# Altium project SR4K_PHY6222_v1.PrjPcb
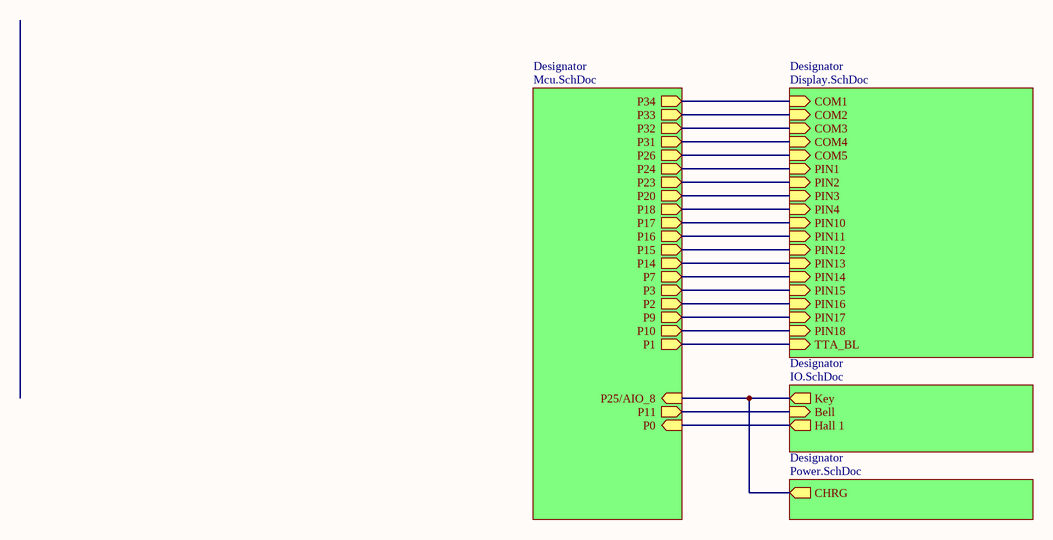
[diagram p0: Main.SchDoc]
5 sheets, 51 parts. Net scope: hierarchical (ports join the sheet entries above them; power ports are global).
Sheets:
  Main.SchDoc
    Designator = Display.SchDoc
    Designator = Power.SchDoc
    Designator = IO.SchDoc
    Designator = Mcu.SchDoc

## Sheet Main.SchDoc: SR4K_PHY6222_SIMPLIFY
size A4; DrawnBy: emmovo@outlook.com; Revision: V1.2; SheetNumber: 1; SheetTotal: 5

### Sub-sheets
Designator = Display.SchDoc: COM1 (in), TTA_BL (in), COM2 (in), COM3 (in), COM4 (in), COM5 (in), PIN1 (in), PIN2 (in), PIN3 (in), PIN4 (in), PIN10 (in), PIN11 (in), PIN12 (in), PIN13 (in), PIN14 (in), PIN15 (in), PIN16 (in), PIN17 (in), PIN18 (in)
Designator = Power.SchDoc: CHRG (out)
Designator = IO.SchDoc: Key (out), Hall 1 (out), Bell (in)
Designator = Mcu.SchDoc: P34 (out), P33 (out), P32 (out), P31 (out), P26 (out), P25/AIO_8 (in), P24 (out), P23 (out), P0 (in), P11 (out), P14 (out), P15 (out), P20 (out), P18 (out), P17 (out), P16 (out), P7 (out), P3 (out), P2 (out), P1 (out), P9 (out), P10 (out)

### Nets
CHRG: sheet Designator/CHRG, sheet Designator/Key, sheet Designator/P25/AIO_8
SWCLK: sheet Designator/PIN15, sheet Designator/P3
SWDIO: sheet Designator/PIN16, sheet Designator/P2
Uart_TX: sheet Designator/PIN17, sheet Designator/P9
NetC1_1: sheet Designator/Bell, sheet Designator/P11
NetR2_2: sheet Designator/TTA_BL, sheet Designator/P1
NetU1_3: sheet Designator/Hall 1, sheet Designator/P0
NetU2_1: sheet Designator/PIN1, sheet Designator/P24
NetU2_2: sheet Designator/PIN2, sheet Designator/P23
NetU2_3: sheet Designator/PIN3, sheet Designator/P20
NetU2_4: sheet Designator/PIN4, sheet Designator/P18
NetU2_5: sheet Designator/COM1, sheet Designator/P34
NetU2_6: sheet Designator/COM2, sheet Designator/P33
NetU2_7: sheet Designator/COM3, sheet Designator/P32
NetU2_8: sheet Designator/COM4, sheet Designator/P31
NetU2_9: sheet Designator/COM5, sheet Designator/P26
NetU2_10: sheet Designator/PIN10, sheet Designator/P17
NetU2_11: sheet Designator/PIN11, sheet Designator/P16
NetU2_12: sheet Designator/PIN12, sheet Designator/P15
NetU2_13: sheet Designator/PIN13, sheet Designator/P14
NetU2_14: sheet Designator/PIN14, sheet Designator/P7
NetU2_18: sheet Designator/PIN18, sheet Designator/P10

### Notes on the sheet
- Title
- Size:
- Date:
- A4
- Number:
- Time:
- Revision:
- Sheet
- emmovo@outlook.com
- of
- File:

## Sheet Display.SchDoc: SR4K_PHY6222_SIMPLIFY
size A4; Revision: V1.2; SheetNumber: 3; SheetTotal: 5
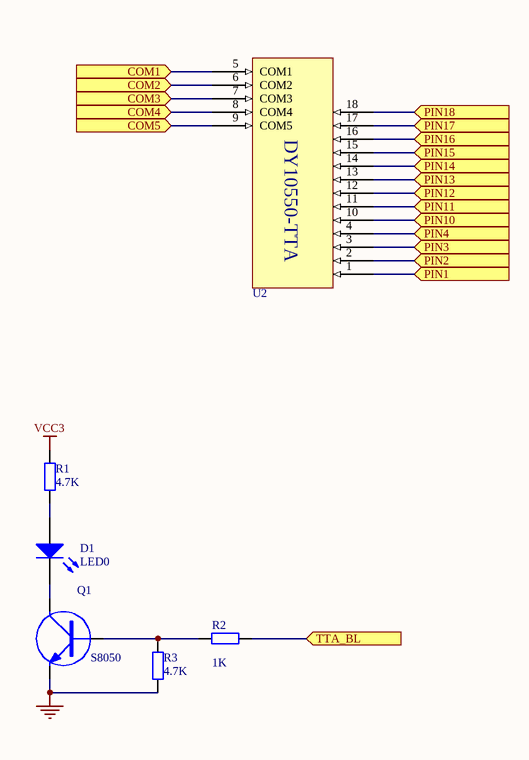
[diagram p1: Display.SchDoc]

### Parts
D1  LED0
Q1  S8050
R1  value 4.7K  (hidden comment: Res2)
R2  value 1K  (hidden comment: Res2)
R3  value 4.7K  (hidden comment: 100K)
U2  DY10550-TTA_1  (value not drawn)

### Ports
COM1 (in), COM2 (in), COM3 (in), COM4 (in), COM5 (in), PIN1 (in), PIN2 (in), PIN3 (in), PIN4 (in), PIN10 (in), PIN11 (in), PIN12 (in), PIN13 (in), PIN14 (in), PIN15 (in), PIN16 (in), PIN17 (in), PIN18 (in), TTA_BL (in)

### Nets
GND: Q1.2(E) R3.1
VCC3: R1.2
SWCLK: U2.15 ; port PIN15
SWDIO: U2.16 ; port PIN16
Uart_TX: U2.17 ; port PIN17
NetD1_1: D1.1(A) R1.1
NetD1_2: D1.2(K) Q1.3(C)
NetQ1_1: Q1.1(B) R2.1 R3.2
NetR2_2: R2.2 ; port TTA_BL
NetU2_1: U2.1 ; port PIN1
NetU2_2: U2.2 ; port PIN2
NetU2_3: U2.3 ; port PIN3
NetU2_4: U2.4 ; port PIN4
NetU2_5: U2.5(COM1) ; port COM1
NetU2_6: U2.6(COM2) ; port COM2
NetU2_7: U2.7(COM3) ; port COM3
NetU2_8: U2.8(COM4) ; port COM4
NetU2_9: U2.9(COM5) ; port COM5
NetU2_10: U2.10 ; port PIN10
NetU2_11: U2.11 ; port PIN11
NetU2_12: U2.12 ; port PIN12
NetU2_13: U2.13 ; port PIN13
NetU2_14: U2.14 ; port PIN14
NetU2_18: U2.18 ; port PIN18

### Notes on the sheet
- Title
- Size:
- Date:
- A4
- Number:
- Time:
- Revision:
- Sheet
- emmovo@outlook.com
- of
- File:
- (in symbol DY10550-TTA_1) DY10550-TTA

### Library data of the parts
D1 = LED0: Typical INFRARED GaAs LED; Published: 8-Jun-2000; LatestRevisionDate: 08-Jul-2005; LatestRevisionNote: Mech Layer 1 removed.; PackageReference: LED-0; Publisher: Altium Limited; PackageDescription: LED; 2 Leads
Q1 = NPN: NPN Transistor
R1-R3 = Res2: Resistor; Published: 8-Jun-2000; LatestRevisionDate: 17-Jul-2002; LatestRevisionNote: Re-released for DXP Platform.; PackageReference: AXIAL-0.4; Publisher: Altium Limited; PackageDescription: Axial Device, Thru-Hole; 2 Leads; 0.4 in Pin Spacing

## Sheet Power.SchDoc: SR4K_PHY6222_SIMPLIFY
size A4; Revision: V1.2; SheetNumber: 4; SheetTotal: 5
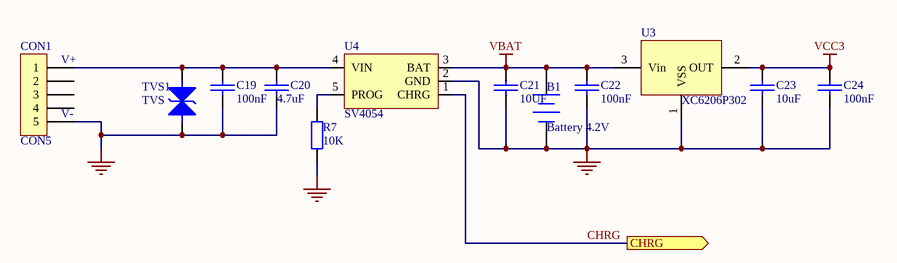
[diagram p2: Power.SchDoc]

### Parts
(Parts that share a designator on the sheet are numbered #1, #2 ... from top to bottom, then left to right.)
B1  Battery 4.2V  [JP2S]
C19  100nF  [0603]
C20  4.7uF  [0603]
C21  10UF  [0603]
C22  100nF  [0603]
C23  10uF  [0603]
C24  100nF  [0603]
CON1  CON5
R7  10K  [AXIAL-0.4]
TVS1  TVS  [SOD-123]
U3#1  XC6206P302  [SOT-23]
U4  SV4054  [SOT-25]

### Ports
CHRG (out)

### Nets
GND: B1.2(-) C19.1 C20.1 C21.1 C22.1 C23.1 C24.1 CON1.5 R7.1 TVS1.1 U3#1.1(VSS) U4.2(GND)
VBAT: B1.1(+) C21.2 C22.2 U3#1.3(Vin) U4.3(BAT)
VCC3: C23.2 C24.2 U3#1.2(OUT)
CHRG: U4.1(CHRG) ; port CHRG
NetC19_2: C19.2 C20.2 CON1.1 TVS1.2 U4.4(VIN)
NetR7_2: R7.2 U4.5(PROG)

Not connected (* = marked no-connect by the designer): CON1 2 3 4

### Notes on the sheet
- (near CON1) V+
- (near CON1) V-
- Title
- Size:
- Date:
- A4
- Number:
- Time:
- Revision:
- Sheet
- emmovo@outlook.com
- of
- File:

### Library data of the parts
B1 = Battery: Multicell Battery; Published: 24-Mar-1999; LatestRevisionDate: 17-Jul-2002; LatestRevisionNote: Re-released for DXP Platform.; PackageReference: BAT-2; Publisher: Altium Limited; PackageDescription: Battery; 2 Leads
C19-C24 = CAP: Capacitor
CON1 = CON5: Connector
R7 = Res2: 1%@100mA; Published: 8-Jun-2000; LatestRevisionDate: 17-Jul-2002; LatestRevisionNote: Re-released for DXP Platform.; PackageReference: AXIAL-0.4; Publisher: Altium Limited; PackageDescription: Axial Device, Thru-Hole; 2 Leads; 0.4 in Pin Spacing; Value: 10K

## Sheet IO.SchDoc: SR4K_PHY6222_SIMPLIFY
size A4; Revision: V1.2; SheetNumber: 5; SheetTotal: 5
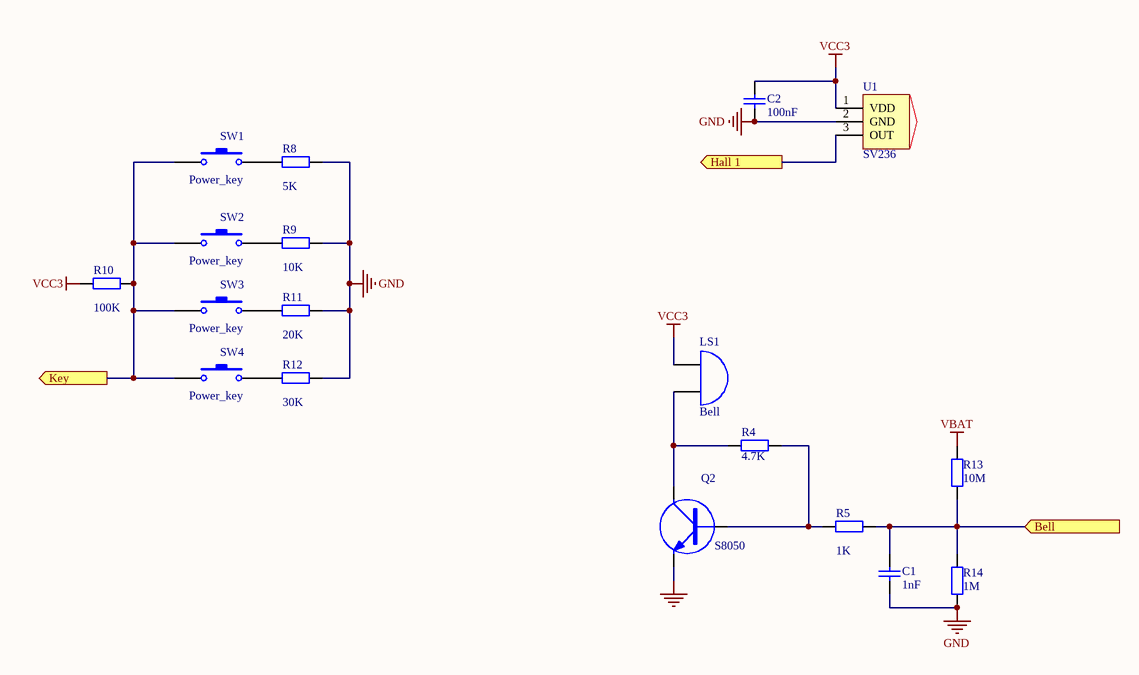
[diagram p3: IO.SchDoc]

### Parts
C1  value 1nF  [RAD-0.3]  (hidden comment: Cap)
C2  value 100nF  [RAD-0.3]  (hidden comment: Cap)
LS1  Bell
Q2  S8050  [SOT-23]
R4  value 4.7K  (hidden comment: 100K)
R5  value 1K  (hidden comment: Res2)
R8  value 5K  (hidden comment: Res2)
R9  value 10K  (hidden comment: Res2)
R10  value 100K  (hidden comment: Res2)
R11  value 20K  (hidden comment: Res2)
R12  value 30K  (hidden comment: Res2)
R13  value 10M  (hidden comment: Res2)
R14  value 1M  (hidden comment: Res2)
SW1  Power_key
SW2  Power_key
SW3  Power_key
SW4  Power_key
U1  SV236  [sot-23-3]

### Ports
Bell (in), Hall 1 (out), Key (out)

### Nets
GND: C1.2 C2.2 Q2.2(E) R8.2 R9.2 R11.2 R12.2 R14.1 U1.2(GND)
VBAT: R13.2
VCC3: C2.1 LS1.1(A) R10.1 U1.1(VDD)
CHRG: R10.2 SW1.1 SW2.1 SW3.1 SW4.1 ; port Key
NetC1_1: C1.1 R5.2 R13.1 R14.2 ; port Bell
NetLS1_2: LS1.2(B) Q2.3(C) R4.2
NetQ2_1: Q2.1(B) R4.1 R5.1
NetR8_1: R8.1 SW1.2
NetR9_1: R9.1 SW2.2
NetR11_1: R11.1 SW3.2
NetR12_1: R12.1 SW4.2
NetU1_3: U1.3(OUT) ; port Hall 1

### Notes on the sheet
- Title
- Size:
- Date:
- A4
- Number:
- Time:
- Revision:
- Sheet
- emmovo@outlook.com
- of
- File:

### Library data of the parts
C1 C2 = Cap: Capacitor; Published: 8-Jun-2000; LatestRevisionDate: 17-Jul-2002; LatestRevisionNote: Re-released for DXP Platform.; PackageReference: RAD-0.3; Publisher: Altium Limited; PackageDescription: Radial Cap, Thru-Hole; 2 Leads; 0.3 in Pin Spacing
LS1 = Bell: Electrical Bell; Published: 24-Mar-1999; LatestRevisionDate: 17-Jul-2002; LatestRevisionNote: Re-released for DXP Platform.; PackageReference: PIN2; Publisher: Altium Limited
Q2 = NPN: NPN Transistor
R4 R5 R8-R14 = Res2: Resistor; Published: 8-Jun-2000; LatestRevisionDate: 17-Jul-2002; LatestRevisionNote: Re-released for DXP Platform.; PackageReference: AXIAL-0.4; Publisher: Altium Limited; PackageDescription: Axial Device, Thru-Hole; 2 Leads; 0.4 in Pin Spacing
SW1-SW4 = SW-PB: Switch; Published: 24-Mar-1999; LatestRevisionDate: 17-Jul-2002; LatestRevisionNote: Re-released for DXP Platform.; PackageReference: SPST-2; Publisher: Altium Limited
U1 = 霍尔44E 938

## Sheet Mcu.SchDoc: SR4K_PHY6222_SIMPLIFY
size A4; Revision: V1.2; SheetNumber: 2; SheetTotal: 5
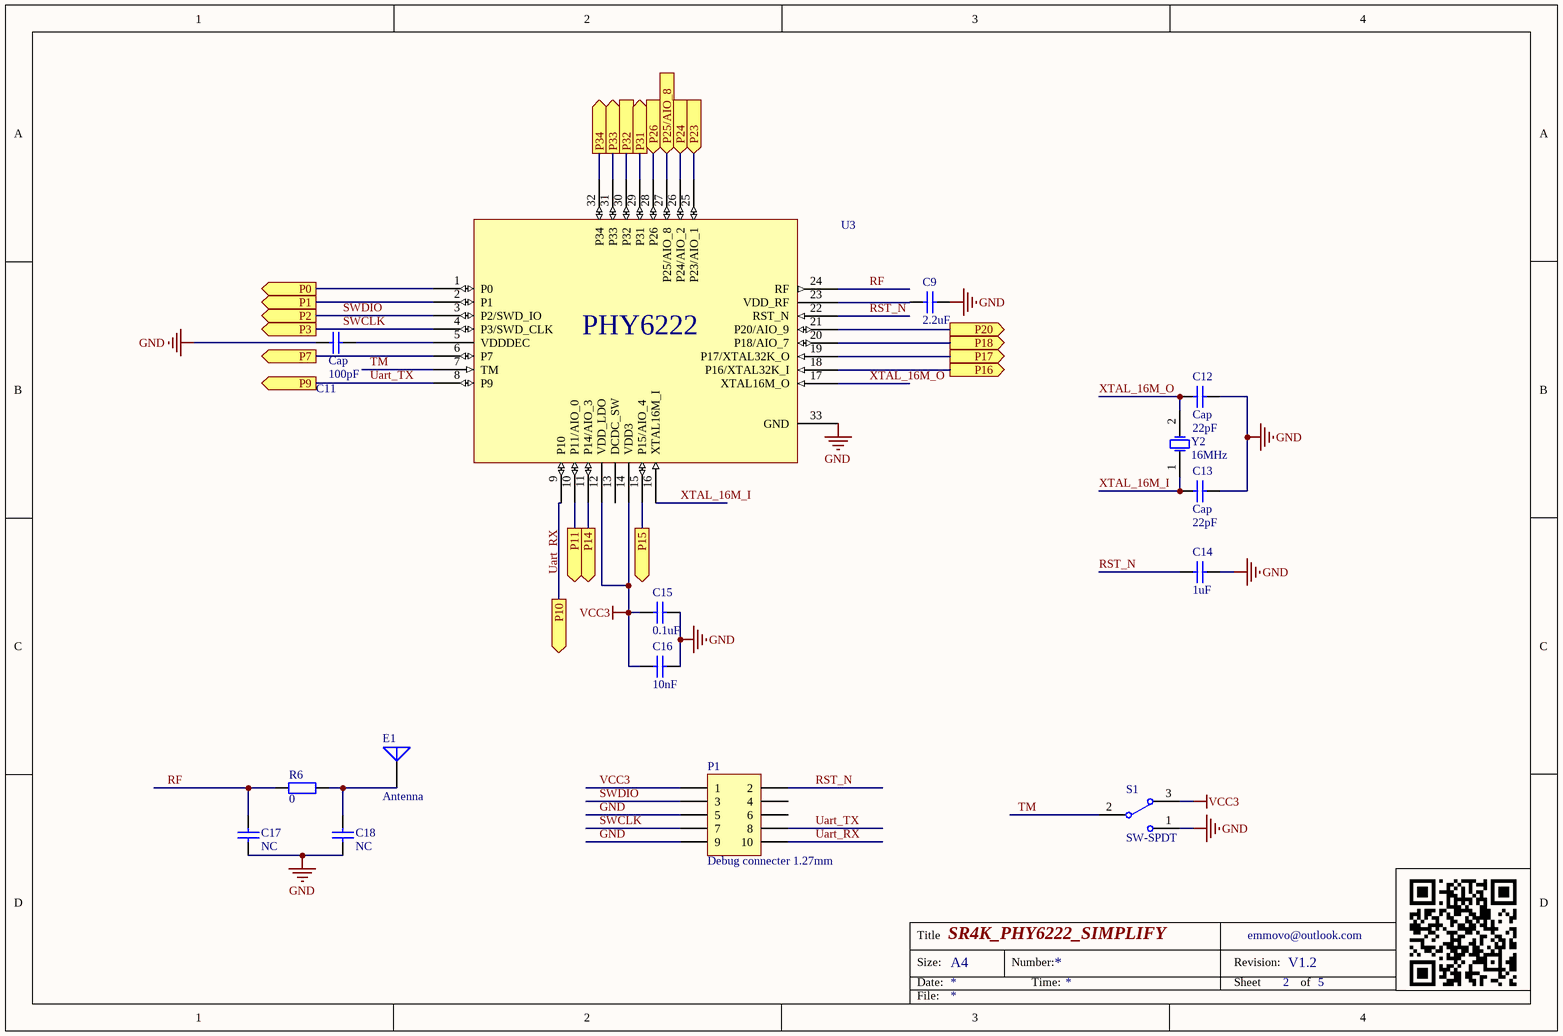
[diagram p4: Mcu.SchDoc]

### Parts
(Parts that share a designator on the sheet are numbered #1, #2 ... from top to bottom, then left to right.)
C9  value 2.2uF  (hidden comment: Cap)
C11  Cap  value 100pF
C12  Cap  value 22pF
C13  Cap  value 22pF
C14  value 1uF  (hidden comment: Cap)
C15  value 0.1uF  (hidden comment: Cap)
C16  value 10nF  (hidden comment: Cap)
C17  value NC  (hidden comment: Cap)
C18  value NC  (hidden comment: Cap)
E1  Antenna  [PIN1]
P1  Debug connecter 1.27mm
R6  0
S1  SW-SPDT
U3#2  U*  (value not drawn)
Y2  16MHz

### Ports
P0 (out), P1 (out), P2 (out), P3 (out), P7 (out), P9 (out), P10 (out), P11 (out), P14 (out), P15 (out), P16 (out), P17 (out), P18 (out), P20 (out), P23 (in), P24 (in), P25/AIO_8 (in), P26 (in), P31 (out), P32, P33 (out), P34 (out)

### Nets
GND: C9.2 C11.1 C12.1 C13.1 C14.2 C15.2 C16.2 C17.2 C18.2 P1.5 P1.9 S1.1 U3#2.33(GND)
VCC3: P1.1 S1.3
CHRG: U3#2.27(P25/AIO_8) ; port P25/AIO_8
RF: C17.1 R6.2 U3#2.24(RF)
RST_N: C14.1 P1.2 U3#2.22(RST_N)
SWCLK: P1.7 U3#2.4(P3/SWD_CLK) ; port P3
SWDIO: P1.3 U3#2.3(P2/SWD_IO) ; port P2
TM: S1.2 U3#2.7(TM)
Uart_RX: P1.10
Uart_TX: P1.8 U3#2.8(P9) ; port P9
XTAL_16M_I: C13.2 U3#2.16(XTAL16M_I) Y2.1(OSC1)
XTAL_16M_O: C12.2 U3#2.17(XTAL16M_O) Y2.2(OSC2)
NetC1_1: U3#2.10(P11/AIO_0) ; port P11
NetC9_1: C9.1 U3#2.23(VDD_RF)
NetC11_2: C11.2 U3#2.5(VDDDEC)
NetC15_1: C15.1 C16.1 U3#2.12(VDD_LDO) U3#2.14(VDD3)
NetC18_1: C18.1 E1.1(A) R6.1
NetR2_2: U3#2.2(P1) ; port P1
NetU1_3: U3#2.1(P0) ; port P0
NetU2_1: U3#2.26(P24/AIO_2) ; port P24
NetU2_2: U3#2.25(P23/AIO_1) ; port P23
NetU2_3: U3#2.21(P20/AIO_9) ; port P20
NetU2_4: U3#2.20(P18/AIO_7) ; port P18
NetU2_5: U3#2.32(P34) ; port P34
NetU2_6: U3#2.31(P33) ; port P33
NetU2_7: U3#2.30(P32) ; port P32
NetU2_8: U3#2.29(P31) ; port P31
NetU2_9: U3#2.28(P26) ; port P26
NetU2_10: U3#2.19(P17/XTAL32K_O) ; port P17
NetU2_11: U3#2.18(P16/XTAL32K_I) ; port P16
NetU2_12: U3#2.15(P15/AIO_4) ; port P15
NetU2_13: U3#2.11(P14/AIO_3) ; port P14
NetU2_14: U3#2.6(P7) ; port P7
NetU2_18: U3#2.9(P10) ; port P10

Not connected (* = marked no-connect by the designer): P1 4 6; U3#2 13(DCDC_SW)

### Notes on the sheet
- Labels drawn without touching a wire or pin: Uart_RX, VCC3
- Title
- Size:
- Date:
- A4
- Number:
- Time:
- Revision:
- Sheet
- emmovo@outlook.com
- of
- File:

### Library data of the parts
C9 C11-C18 = Cap: Capacitor; Published: 8-Jun-2000; LatestRevisionDate: 17-Jul-2002; LatestRevisionNote: Re-released for DXP Platform.; PackageReference: RAD-0.3; Publisher: Altium Limited; PackageDescription: Radial Cap, Thru-Hole; 2 Leads; 0.3 in Pin Spacing
E1 = Antenna: Generic Antenna; Published: 24-Mar-1999; LatestRevisionDate: 17-Jul-2002; LatestRevisionNote: Re-released for DXP Platform.; PackageReference: PIN1; Publisher: Altium Limited
P1 = Header 5X2: Header, 5-Pin, Dual row; LatestRevisionDate: 17-Jul-2002; LatestRevisionNote: Re-released for DXP Platform.; Publisher: Altium Limited
R6 = Res2: Resistor; Published: 8-Jun-2000; LatestRevisionDate: 17-Jul-2002; LatestRevisionNote: Re-released for DXP Platform.; PackageReference: AXIAL-0.4; Publisher: Altium Limited; PackageDescription: Axial Device, Thru-Hole; 2 Leads; 0.4 in Pin Spacing; Value: 0
S1 = SW-SPDT: SPDT Subminiature Toggle Switch, Right Angle Mounting, Vertical Actuation; Published: 24-Mar-1999; LatestRevisionDate: 17-Dec-2003; LatestRevisionNote: Schematic revised, PCB Footprint replaced.; DatasheetVersion: 05-Dec-2000; PackageReference: TL36WW15050; Publisher: Altium Limited; PackageDescription: Switch; 4 Leads; ComponentLink1Description: Manufacturer Link; ComponentLink1URL: http://www.apem.com
U3#2 = PHY6222
Y2 = XTAL: Crystal Oscillator; Published: 8-Jun-2000; LatestRevisionDate: 17-Jul-2002; LatestRevisionNote: Re-released for DXP Platform.; PackageReference: R38; Publisher: Altium Limited; PackageDescription: Crystal, Thru-Hole; 2 Leads; Body 3.1 x 8.2 mm (Dia.xH)

## Nets that join several sheets
GND: Display (Q1.2 R3.1), Power (12 pins), IO (9 pins), Mcu (13 pins)
VBAT: Power (5 pins), IO (R13.2)
VCC3: Display (R1.2), Power (C23.2 C24.2 U3#1.2), IO (C2.1 LS1.1 R10.1 U1.1), Mcu (P1.1 S1.3)
CHRG: Power (U4.1), IO (5 pins), Mcu (U3#2.27)
NetC1_1: IO (C1.1 R5.2 R13.1 R14.2), Mcu (U3#2.10)
NetR2_2: Display (R2.2), Mcu (U3#2.2)
NetU1_3: IO (U1.3), Mcu (U3#2.1)
NetU2_1: Display (U2.1), Mcu (U3#2.26)
NetU2_2: Display (U2.2), Mcu (U3#2.25)
NetU2_3: Display (U2.3), Mcu (U3#2.21)
NetU2_4: Display (U2.4), Mcu (U3#2.20)
NetU2_5: Display (U2.5), Mcu (U3#2.32)
NetU2_6: Display (U2.6), Mcu (U3#2.31)
NetU2_7: Display (U2.7), Mcu (U3#2.30)
NetU2_8: Display (U2.8), Mcu (U3#2.29)
NetU2_9: Display (U2.9), Mcu (U3#2.28)
NetU2_10: Display (U2.10), Mcu (U3#2.19)
NetU2_11: Display (U2.11), Mcu (U3#2.18)
NetU2_12: Display (U2.12), Mcu (U3#2.15)
NetU2_13: Display (U2.13), Mcu (U3#2.11)
NetU2_14: Display (U2.14), Mcu (U3#2.6)
NetU2_18: Display (U2.18), Mcu (U3#2.9)
SWCLK: Display (U2.15), Mcu (P1.7 U3#2.4)
SWDIO: Display (U2.16), Mcu (P1.3 U3#2.3)
Uart_TX: Display (U2.17), Mcu (P1.8 U3#2.8)